# EAGLE design D32 Pro - TFT OneSize (EAGLE 9.6.2)
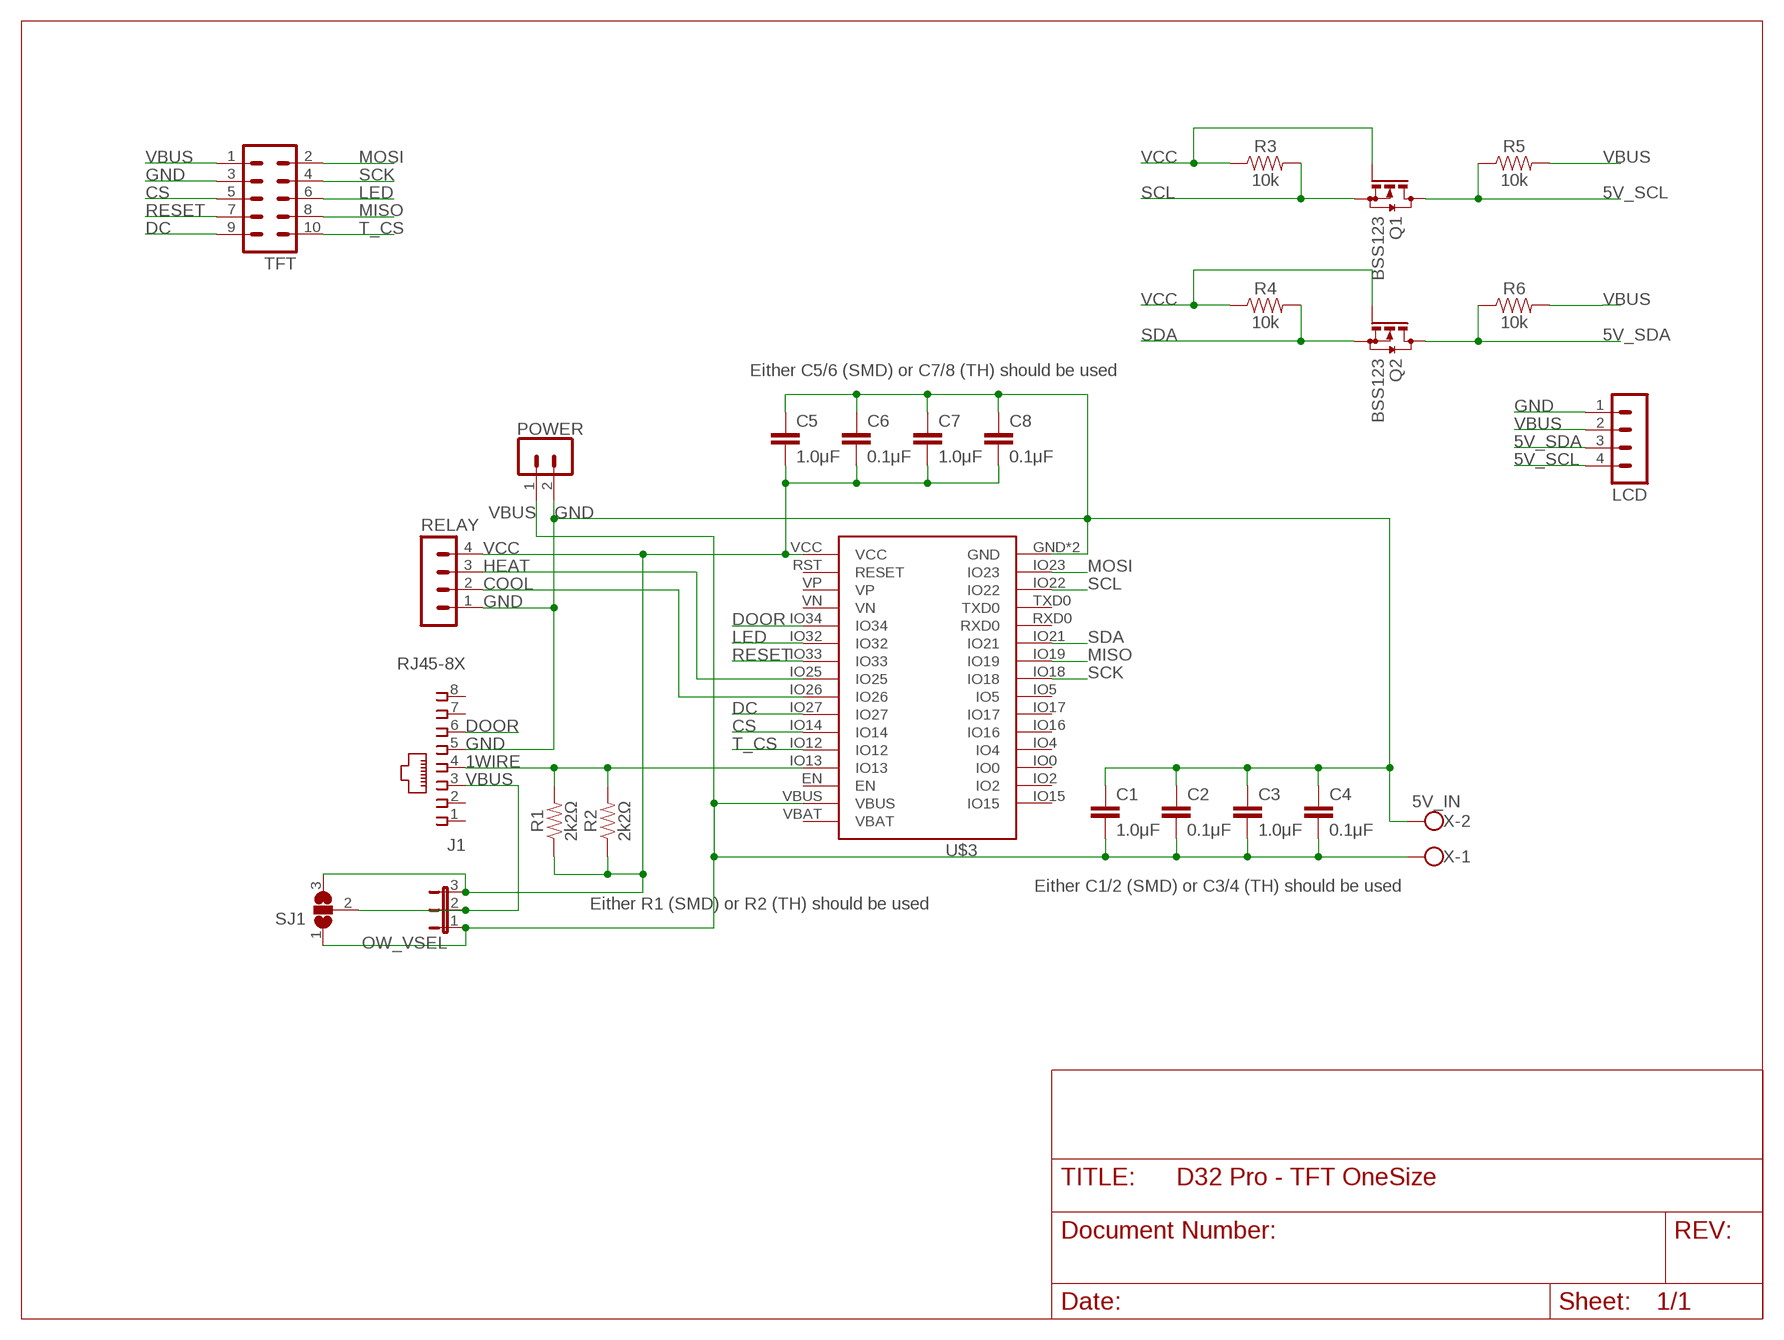
[diagram p0: schematic, sheet 1]

## Parts
C1  1.0μF  CAP_SMD1206  [SMD-1206]
C2  0.1μF  CAP_SMD1206  [SMD-1206]
C3  1.0μF  CAP_CERAMIC_2.54  [CAP_PTH-2.54]
C4  0.1μF  CAP_CERAMIC_2.54  [CAP_PTH-2.54]
C5  1.0μF  CAP_SMD1206  [SMD-1206]
C6  0.1μF  CAP_SMD1206  [SMD-1206]
C7  1.0μF  CAP_CERAMIC_2.54  [CAP_PTH-2.54]
C8  0.1μF  CAP_CERAMIC_2.54  [CAP_PTH-2.54]
J1  RJ45-8X  [RJ45-NO-SHIELD-NOLINE]
LCD  HDR-4  [HDR-4_VERT]
OW_VSEL  JP2E  [JP2]
Q1  BSS123  [SOT23]
Q2  BSS123  [SOT23]
R1  2k2Ω  RES_SMD1206  [SMD-1206]
R2  2k2Ω  1KOHM-HORIZ-1/4W-5%  [AXIAL-0.3]
R3  10k  RES_SMD1206  [SMD-1206]
R4  10k  RES_SMD1206  [SMD-1206]
R5  10k  RES_SMD1206  [SMD-1206]
R6  10k  RES_SMD1206  [SMD-1206]
RELAY  HDR-4  [HDR-4_VERT]
SJ1  SJ2WW  [SJ_2W]
TFT  MA05-2  [MA05-2]
U$3  WEMOS-D32D32_PRO_NO-BATT  [D32_PRO_NO-BATT]
U$5  POWER  HDR-2  [HDR-2_VERT]
X  5V_IN  W237-102  [W237-102]

## Nets
1WIRE: J1.4 R1.2 R2.P$2 U$3.IO13
5V_SCL: LCD.4 Q1.3(D) R5.1
5V_SDA: LCD.3 Q2.3(D) R6.1
COOL: RELAY.2 U$3.IO26
CS: TFT.5 U$3.IO14
DC: TFT.9 U$3.IO27
DOOR: J1.6 U$3.IO34
GND [Gnd]: C1.1 C2.1 C3.1 C4.1 C5.1 C6.1 C7.1 C8.1 J1.5 LCD.1 RELAY.1 TFT.3 U$3.GND U$3.GND2(GND) U$5.2 X.2
HEAT: RELAY.3 U$3.IO25
LED: TFT.6 U$3.IO32
MISO: TFT.8 U$3.IO19
MOSI: TFT.2 U$3.IO23
N$1: J1.3 OW_VSEL.2 SJ1.2
RESET: TFT.7 U$3.IO33
SCK: TFT.4 U$3.IO18
SCL: Q1.2(S) R3.2 U$3.IO22
SDA: Q2.2(S) R4.2 U$3.IO21
T_CS: TFT.10 U$3.IO12
VBUS [5v]: C1.2 C2.2 C3.2 C4.2 LCD.2 OW_VSEL.1 R5.2 R6.2 SJ1.1 TFT.1 U$3.VBUS U$5.1 X.1
VCC [3v]: C5.2 C6.2 C7.2 C8.2 OW_VSEL.3 Q1.1(G) Q2.1(G) R1.1 R2.P$1 R3.1 R4.1 RELAY.4 SJ1.3 U$3.VCC
Unconnected: J1.1 J1.2 J1.7 J1.8 U$3.EN U$3.IO0 U$3.IO2 U$3.IO4 U$3.IO5 U$3.IO15 U$3.IO16 U$3.IO17 U$3.RST(RESET) U$3.RXD0 U$3.TXD0 U$3.VBAT U$3.VN U$3.VP

## Notes on the sheet
- Either C5/6 (SMD) or C7/8 (TH) should be used
- Either C1/2 (SMD) or C3/4 (TH) should be used
- Either R1 (SMD) or R2 (TH) should be used

## Library data of the parts
C1 C2 C5 C6 = Donnie:CAP_SMD
C3 C4 C7 C8 = Donnie:CAP_CERAMIC_2.54
J1 = con-tycoelectronics:RJ45: CORCOM Modular RJ Jacks No Shield Source: www.tycoelectronics.com .. ENG_DS_1654001_1099_RJ_L_0507.pdf; MPN: RJ45-8X; OC_FARNELL: unknown; OC_NEWARK: 16R6101
LCD RELAY = Donnie:HDR-4: PIN HEADER
OW_VSEL = Donnie:JP2E: JUMPER
Q1 Q2 = transistor-small-signal:BSS123: N-CHANNEL MOS FET
R1 R3-R6 = Donnie:RES_SMD
R2 = SparkFun-Resistors:1KOHM: 1kΩ resistor A resistor is a passive two-terminal electrical component that implements electrical resistance as a circuit element. Resistors act to reduce current flow, and, at the same time, act to lower voltage levels within circuits. - Wikipedia; PROD_ID: RES-08380; VALUE: 1k
SJ1 = jumper:SJ2W: SMD solder JUMPER
TFT = Box Header:MA05-2: PIN HEADER; OC_FARNELL: unknown; OC_NEWARK: unknown
U$3 = Donnie:WEMOS-D32: D32_REVERSE is a Reverse silkscreen for placing the Wemos D32 on the underside of the board D32_NO-KEEPOUT removes the keepout area beneath the antenna on the D32 and provides a note to avoid components and traces.
U$5 = Donnie:HDR-2
X = con-wago-500:W237-102: WAGO SCREW CLAMP; MPN: 237-102; OC_FARNELL: unknown; OC_NEWARK: 70K9898

## Net classes
0 default: width 0.406 mm, clearance 0.406 mm
1 5v: width 0.406 mm, clearance 0.406 mm
2 3v: width 0.406 mm, clearance 0.406 mm
3 Gnd: width 0.406 mm, clearance 0.406 mm

## Board
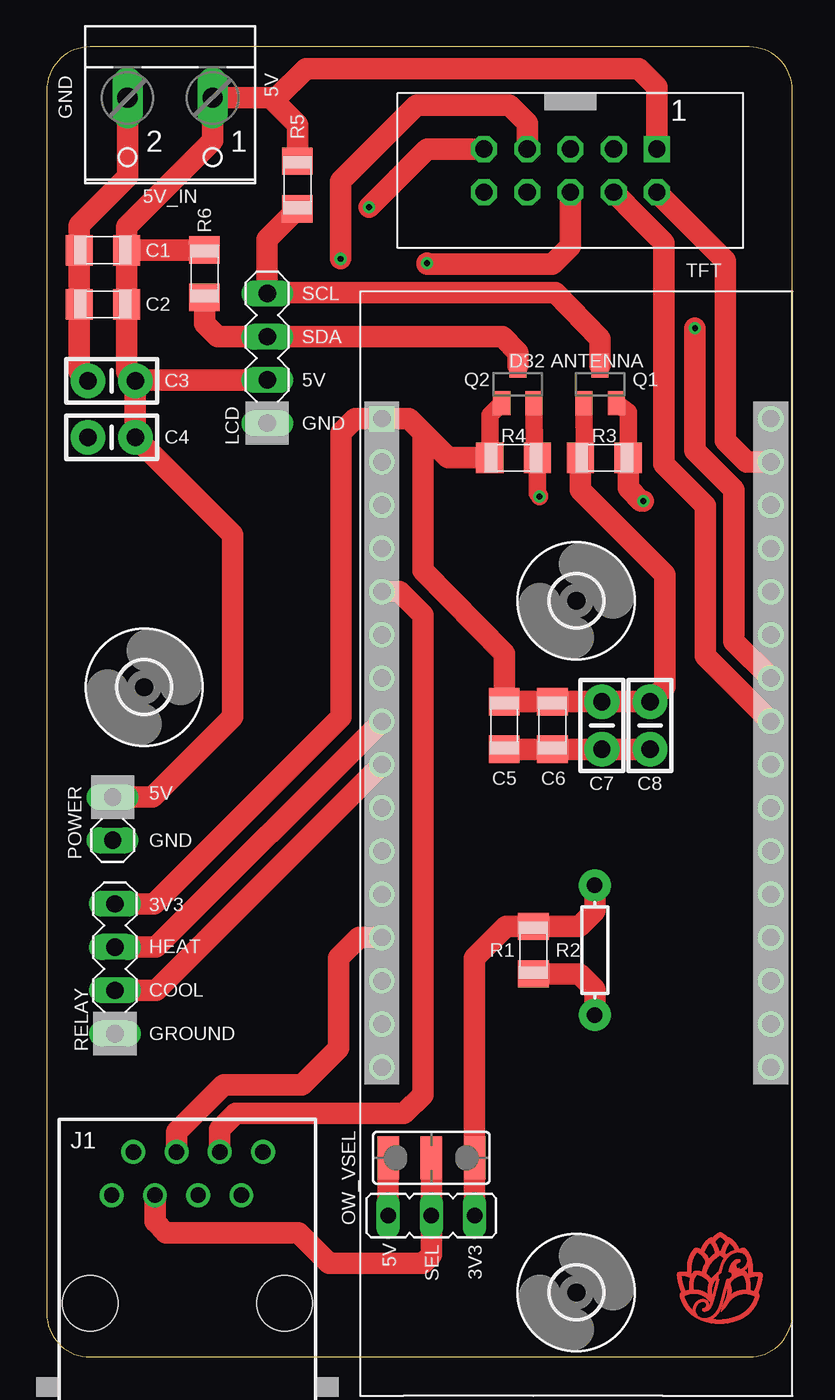
[diagram p1: board, top side]
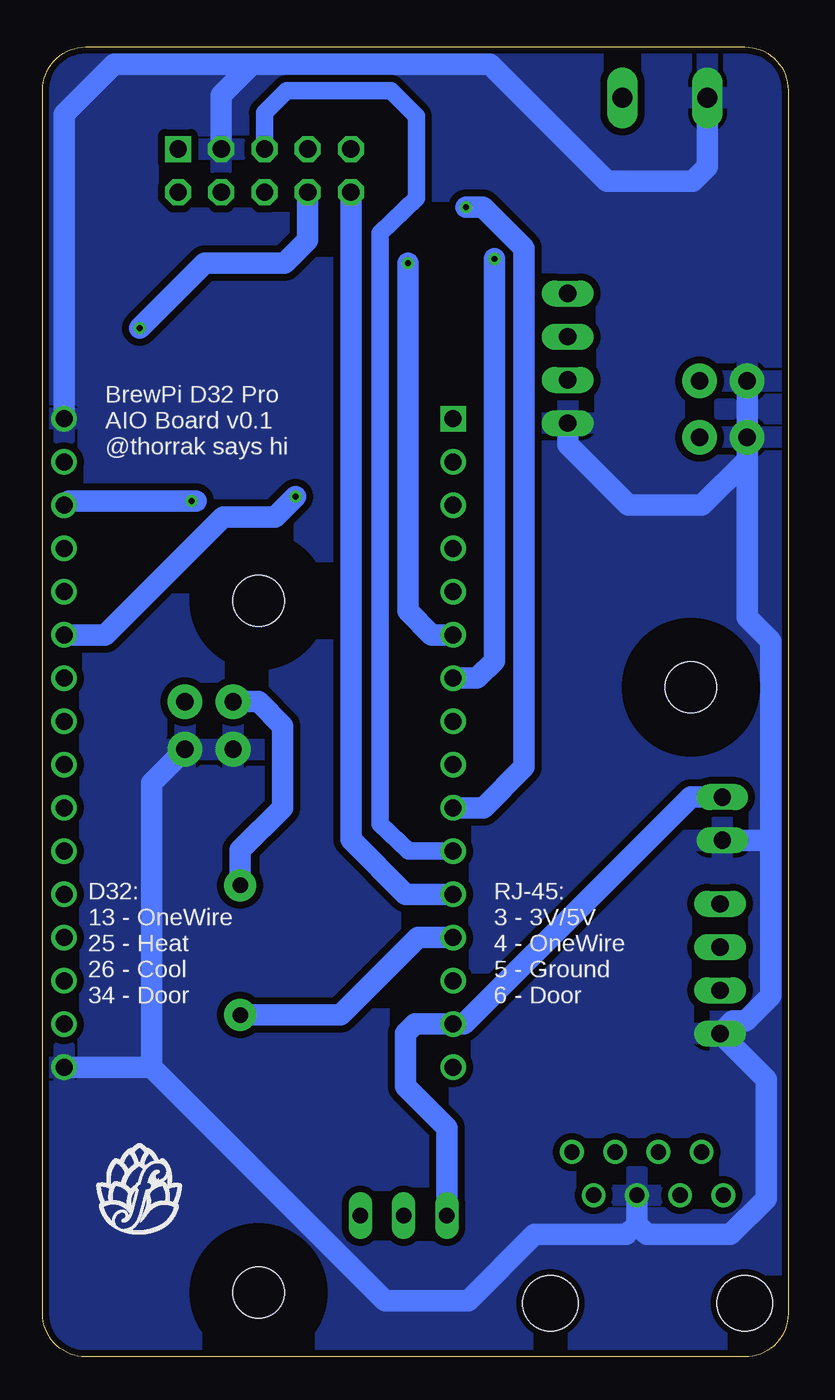
[diagram p2: board, bottom side, seen from below]

Size 43.81 x 76.97 mm. Coordinates in mm from the lower left corner, seen from the top.
Outline: 2.54,0 41.27,0 arc90 43.81,2.54 43.81,74.43 arc90 41.27,76.97 2.54,76.97 arc90 0,74.43 0,2.54 arc90 2.54,0
Copper layers (1*16): Top 0.0356mm / dielectric 1.5011mm / Bottom 0.0356mm
Design rules "PCBs_io *": minimum track width 6mil, minimum drill 13mil, track to track 8mil, track to pad 8mil, pad to pad 8mil, via to via 8mil, smd to smd 8mil, copper to edge 15mil, drill to drill 6mil, minimum pad ring 7mil, minimum via ring 7mil, stop-mask expansion 3mil, vias tented up to drill 0mil, thermal gap 10mil

### Footprints (pad centres in the part's own frame; a part is rotated, then mirrored left to right if it is on the bottom)
SMD-1206 = smd 1.6 x 1.8: 1 -1.4,0; 2 1.4,0
CAP_PTH-2.54 = drill 1.016 pad 2.032: 1 -1.397,0; 2 1.397,0
RJ45-NO-SHIELD-NOLINE = drill 0.9 pad 1.4: 1 -4.445,6.35; 2 -3.175,8.89; 3 -1.905,6.35; 4 -0.635,8.89; 5 0.635,6.35; 6 1.905,8.89; 7 3.175,6.35; 8 4.445,8.89 | hole 3.251: -5.715,0; 5.715,0
HDR-4_VERT = drill 1.016 long: 1 0,0; 2 2.54,0; 3 5.08,0; 4 7.62,0
JP2 = drill 0.914 long: 1 -2.54,0; 2 0,0; 3 2.54,0
SOT23 = smd 1 x 1.4: 1 -0.95,-1.1; 2 0.95,-1.1; 3 0,1.1
AXIAL-0.3 = drill 0.9 pad 1.88: P$1 -3.81,0; P$2 3.81,0
SJ_2W = smd 1.27 x 2.54: 1 -2.54,0; 2 0,0; 3 2.54,0
MA05-2 = drill 1.016 square: 1 -5.08,-1.27 | drill 1.016 octagon: 2 -5.08,1.27; 3 -2.54,-1.27; 4 -2.54,1.27; 5 0,-1.27; 6 0,1.27; 7 2.54,-1.27; 8 2.54,1.27; 9 5.08,-1.27; 10 5.08,1.27
3,0 = hole 3: 0,0
D32_PRO_NO-BATT = drill 1: EN -11.43,-12.7; GND 11.43,20.32; GND2 11.43,-17.78; IO0 11.43,-10.16; IO2 11.43,-12.7; IO4 11.43,-7.62; IO5 11.43,0; IO12 -11.43,-7.62; IO13 -11.43,-10.16; IO14 -11.43,-5.08; IO15 11.43,-15.24; IO16 11.43,-5.08; IO17 11.43,-2.54; IO18 11.43,2.54; IO19 11.43,5.08; IO21 11.43,7.62; IO22 11.43,15.24; IO23 11.43,17.78; IO25 -11.43,2.54; IO26 -11.43,0; IO27 -11.43,-2.54; IO32 -11.43,7.62; IO33 -11.43,5.08; IO34 -11.43,10.16; RST -11.43,17.78; RXD0 11.43,10.16; TXD0 11.43,12.7; VBAT -11.43,-17.78; VBUS -11.43,-15.24; VN -11.43,12.7; VP -11.43,15.24 | drill 1 square: VCC -11.43,20.32
HDR-2_VERT = drill 1.016 long: 1 0,0; 2 2.54,0
W237-102 = drill 1.194 long: 1 -2.5,-1.27; 2 2.5,-1.27

### Placement (x,y rotation side)
C1  3.3,65.02 0 top
C2  3.3,61.85 0 top
C3  3.81,57.35 0 top
C4  3.81,54.03 0 top
C5  26.89,37.1 90 top
C6  29.72,37.1 90 top
C7  32.62,37.1 90 top
C8  35.45,37.1 90 top
J1  8.26,3.15 0 top
LCD  12.95,54.86 90 top
OW_VSEL  22.6,8.3 0 top
Q1  32.51,57.15 0 top
Q2  27.69,57.15 0 top
R1  28.6,23.9 270 top
R2  32.2,23.9 270 top
R3  32.77,52.83 0 top
R4  27.43,52.83 0 top
R5  14.73,68.86 90 top
R6  9.27,63.65 90 top
RELAY  4,19 90 top
SJ1  22.6,11.7 0 top
TFT  30.78,69.7 180 top
U$1  [3,0]  31.12,44.43 0 top
U$2  [3,0]  5.72,39.35 0 top
U$3  31.12,34.8 0 top
U$4  [3,0]  31.12,3.79 0 top
U$5  3.87,32.89 270 top
X  7.25,72.71 180 top

### Tracks (layer width: path | path; a pad name or v marks a point on that pad's centre or on a via)
1WIRE
  Top 1.27: J1.4 7.62,13.22 10.4,16 15.01,16 17.15,18.14 17.15,23.45 18.34,24.64 U$3.IO13 | R2.P$2 32.2,21.6 31.3,22.5 R1.2
  Bottom 1.27: U$3.IO13 21.76,24.64 26.31,20.09 R2.P$2
5V_SCL
  Top 1.27: Q1.3 32.51,59.82 29.9,62.54 13.01,62.54 LCD.4 12.95,65.68 R5.1
5V_SDA
  Top 1.27: Q2.3 27.69,59.02 26.77,59.94 LCD.3 10.05,59.94 9.27,60.72 R6.1
COOL
  Top 1.27: U$3.IO26 6.43,21.54 RELAY.2
CS
  Bottom 1.016: U$3.IO14 22.3,29.72 23.98,31.32 23.98,66.02 21.84,68.07 21.84,72.9 23.36,74.41 29.46,74.41 30.78,73.1 TFT.5
DC  (via drill 0.35)
  Top 1.27: TFT.9 22.36,70.97 v18.95,67.56
  Bottom 1.27: U$3.IO27 17.91,32.26 15.52,34.65 15.52,65.13 17.95,67.56 v18.95,67.56
DOOR
  Top 1.27: J1.6 10.16,13.37 11.1,14.3 21,14.3 22.1,15.4 22.1,43.6 20.74,44.96 U$3.IO34
GND
  Top 1.27: C5.1 C6.1 C7.1 C8.1 | X.2 4.75,69.34 1.9,66.5 C1.1 C2.1 1.9,57.86 C3.1
  Bottom 1.27: U$3.GND2 37.42,17.02 | 37.42,17.02 23.7,3.3 18.8,3.3 14.9,7.2 9.5,7.2 8.89,7.8 J1.5 8.89,7.79 8.3,7.2 3.4,7.2 1.3,9.3 1.3,16.3 RELAY.1 3.26,19.74 2.49,19.74 1.02,21.21 1.02,30.48 | TFT.3 33.32,74.14 31.5,75.96 | 31.5,75.96 17.54,75.96 10.67,69.09 5.59,69.09 4.75,69.93 X.2 | U$3.GND 42.55,70.91 42.54,73.03 39.61,75.96 31.5,75.96 | C3.1 C4.1 2.41,52.7 | LCD.1 12.95,53.59 9.4,50.04 5.08,50.04 2.41,52.7 | 2.41,52.7 2.41,43.45 1.02,42.06 1.02,30.48 | U$5.2 1.15,30.35 1.02,30.48 | C8.1 37.42,33.73 37.42,17.02
  pour Bottom: 0,76.2 43.94,76.2 43.94,0 44.2,0 42.93,-1.27 0,-1.27
HEAT
  Top 1.27: U$3.IO25 6.43,24.08 RELAY.3
LED  (via drill 0.35)
  Top 1.27: TFT.6 30.78,65.27 29.72,64.21 22.35,64.21 v22.35,64.26
  Bottom 1.27: v22.35,64.26 22.35,43.81 20.96,42.42 U$3.IO32
MISO  (via drill 0.35)
  Top 1.27: U$3.IO19 40.39,42.04 40.39,50.97 38.1,53.26 v38.1,60.45
  Bottom 1.27: TFT.8 28.24,65.63 29.6,64.26 34.29,64.26 v38.1,60.45
MOSI
  Top 1.27: U$3.IO23 41.15,52.58 39.88,53.85 39.88,64.41 TFT.2
N$1
  Top 1.27: J1.3 6.36,7.95 7,7.3 14.8,7.3 16.6,5.5 22.1,5.5 22.6,6 OW_VSEL.2 SJ1.2
RESET  (via drill 0.35)
  Top 1.27: TFT.7 28.26,71 28.26,72.48 27.2,73.54 21.72,73.54 17.27,69.09 v17.27,64.52
  Bottom 1.27: U$3.IO33 18.29,39.88 17.27,40.89 v17.27,64.52
SCK
  Top 1.27: TFT.4 34.05,67.69 36.27,65.47 36.27,52.46 38.71,50.02 38.71,41.19 U$3.IO18
SCL  (via drill 0.35)
  Top 1.016: Q1.2 34.17,55.5 R3.2
  Top 1.27: R3.2 34.17,51.05 34.93,50.29 v35.05,50.29
  Bottom 1.27: v35.05,50.29 34.8,50.29 42.3,50.29 U$3.IO22
SDA  (via drill 0.35)
  Top 1.016: v28.96,50.55 28.96,50.61 28.83,50.73 R4.2 28.66,53.01 Q2.2
  Bottom 1.27: U$3.IO21 40.13,42.42 33.21,49.34 30.16,49.34 v28.96,50.55
T_CS
  Bottom 1.27: TFT.10 25.7,30.39 22.48,27.18 U$3.IO12
VBUS
  Top 1.27: OW_VSEL.1 SJ1.1 | TFT.1 35.86,74.65 34.8,75.7 15.24,75.7 13.52,73.98 13.14,73.98 | C1.2 4.7,66.42 9.75,71.47 X.1 13.14,73.98 | C1.2 C2.2 4.83,61.73 C2.2 4.7,57.85 C3.2 | C3.2 C4.2 10.92,48.32 10.92,37.59 6.22,32.89 U$5.1 | R6.2 9.25,65.02 C1.2 | R5.2 14.73,72.39 13.14,73.98 | LCD.2 5.26,57.4 C3.2
  Bottom 1.27: OW_VSEL.1 20.06,13.46 22.5,15.9 22.5,19 21.94,19.56 U$3.VBUS 19.06,19.56 5.72,32.89 U$5.1
VCC
  Top 1.016: R3.1 31.58,53.05 Q1.1 | R4.1 26.03,55.33 Q2.1
  Top 1.27: 22.1,54.3 22.1,46.2 26.89,41.33 C5.2 C6.2 C7.2 C8.2 36.32,39.37 36.32,45.97 31.37,50.93 R3.1 | 22.1,54.3 21.28,55.12 U$3.VCC 18.12,55.12 17.3,54.3 17.3,37.61 6.31,26.62 RELAY.4 | R2.P$1 32.2,26.2 31.3,25.3 R1.1 27,25.3 25.14,23.44 SJ1.3 OW_VSEL.3 | R4.1 23.57,52.83 22.1,54.3
  Bottom 1.27: R2.P$1 32.2,29.77 29.72,32.26 29.72,37.08 31.13,38.5 C7.2
(copper drawn outside any net)
  shapes: Top area x12776

### Text on the board
tNames: GND | 5V | SCL | SDA | 5V | GND | 5V | GND | 3V3 | HEAT | COOL | GROUND | 5V | SEL | 3V3
bNames: BrewPi D32 Pro / AIO Board v0.1 / @thorrak says hi | RJ-45: / 3 - 3V/5V / 4 - OneWire / 5 - Ground / 6 - Door | D32: / 13 - OneWire / 25 - Heat / 26 - Cool / 34 - Door